# Altium schematic sheet Key_Matrix.SchDoc
size A4; SheetNumber: 1; SheetTotal: 1
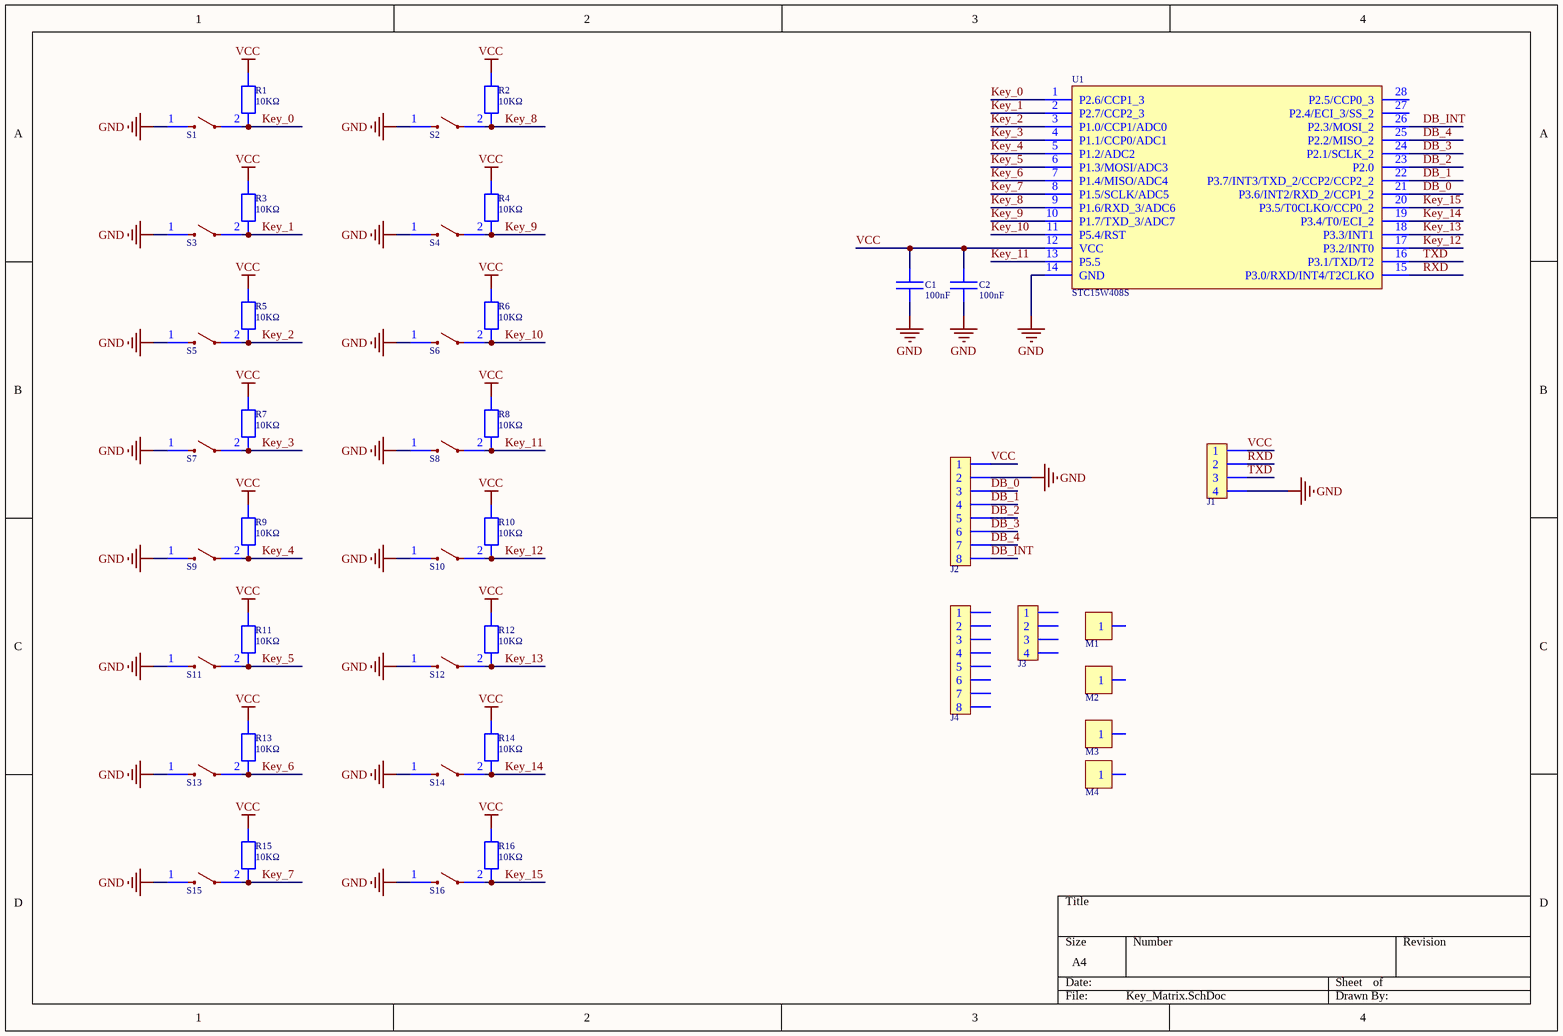
[diagram p0: Key_Matrix.SchDoc]

## Parts
C1  100nF  [C0603]
C2  100nF  [C0603]
J1  PinHeader_4Pin  [PinHeader_4Pin-2.54mm]  (value not drawn)
J2  PinHeader_8Pin  [PinHeader_8Pin-2.54mm]  (value not drawn)
J3  PinHeader_4Pin  [PinHeader_4Pin-2.54mm]  (value not drawn)
J4  PinHeader_8Pin  [PinHeader_8Pin-2.54mm]  (value not drawn)
M1  PCB Mounting Hole  [PCB Mounting Hole]  (value not drawn)
M2  PCB Mounting Hole  [PCB Mounting Hole]  (value not drawn)
M3  PCB Mounting Hole  [PCB Mounting Hole]  (value not drawn)
M4  PCB Mounting Hole  [PCB Mounting Hole]  (value not drawn)
R1  10KΩ  [R0805]
R2  10KΩ  [R0805]
R3  10KΩ  [R0805]
R4  10KΩ  [R0805]
R5  10KΩ  [R0805]
R6  10KΩ  [R0805]
R7  10KΩ  [R0805]
R8  10KΩ  [R0805]
R9  10KΩ  [R0805]
R10  10KΩ  [R0805]
R11  10KΩ  [R0805]
R12  10KΩ  [R0805]
R13  10KΩ  [R0805]
R14  10KΩ  [R0805]
R15  10KΩ  [R0805]
R16  10KΩ  [R0805]
S1  CK_RS282G05A3  [Tactile Button_SMD-SPST_L6.1-W3.7-H2.5]  (value not drawn)
S2  CK_RS282G05A3  [Tactile Button_SMD-SPST_L6.1-W3.7-H2.5]  (value not drawn)
S3  CK_RS282G05A3  [Tactile Button_SMD-SPST_L6.1-W3.7-H2.5]  (value not drawn)
S4  CK_RS282G05A3  [Tactile Button_SMD-SPST_L6.1-W3.7-H2.5]  (value not drawn)
S5  CK_RS282G05A3  [Tactile Button_SMD-SPST_L6.1-W3.7-H2.5]  (value not drawn)
S6  CK_RS282G05A3  [Tactile Button_SMD-SPST_L6.1-W3.7-H2.5]  (value not drawn)
S7  CK_RS282G05A3  [Tactile Button_SMD-SPST_L6.1-W3.7-H2.5]  (value not drawn)
S8  CK_RS282G05A3  [Tactile Button_SMD-SPST_L6.1-W3.7-H2.5]  (value not drawn)
S9  CK_RS282G05A3  [Tactile Button_SMD-SPST_L6.1-W3.7-H2.5]  (value not drawn)
S10  CK_RS282G05A3  [Tactile Button_SMD-SPST_L6.1-W3.7-H2.5]  (value not drawn)
S11  CK_RS282G05A3  [Tactile Button_SMD-SPST_L6.1-W3.7-H2.5]  (value not drawn)
S12  CK_RS282G05A3  [Tactile Button_SMD-SPST_L6.1-W3.7-H2.5]  (value not drawn)
S13  CK_RS282G05A3  [Tactile Button_SMD-SPST_L6.1-W3.7-H2.5]  (value not drawn)
S14  CK_RS282G05A3  [Tactile Button_SMD-SPST_L6.1-W3.7-H2.5]  (value not drawn)
S15  CK_RS282G05A3  [Tactile Button_SMD-SPST_L6.1-W3.7-H2.5]  (value not drawn)
S16  CK_RS282G05A3  [Tactile Button_SMD-SPST_L6.1-W3.7-H2.5]  (value not drawn)
U1  STC15W408S  [SOIC_28Pin-L17.9-W7.5]

## Nets
GND: C1.1 C2.1 J1.4 J2.2 S1.1 S2.1 S3.1 S4.1 S5.1 S6.1 S7.1 S8.1 S9.1 S10.1 S11.1 S12.1 S13.1 S14.1 S15.1 S16.1 U1.14(GND)
VCC: C1.2 C2.2 J1.1 J2.1 R1.2 R2.2 R3.2 R4.2 R5.2 R6.2 R7.2 R8.2 R9.2 R10.2 R11.2 R12.2 R13.2 R14.2 R15.2 R16.2 U1.12(VCC)
DB_0: J2.3 U1.21(P3.6/INT2/RXD_2/CCP1_2)
DB_1: J2.4 U1.22(P3.7/INT3/TXD_2/CCP2/CCP2_2)
DB_2: J2.5 U1.23(P2.0)
DB_3: J2.6 U1.24(P2.1/SCLK_2)
DB_4: J2.7 U1.25(P2.2/MISO_2)
DB_INT: J2.8 U1.26(P2.3/MOSI_2)
Key_0: R1.1 S1.2 U1.1(P2.6/CCP1_3)
Key_1: R3.1 S3.2 U1.2(P2.7/CCP2_3)
Key_2: R5.1 S5.2 U1.3(P1.0/CCP1/ADC0)
Key_3: R7.1 S7.2 U1.4(P1.1/CCP0/ADC1)
Key_4: R9.1 S9.2 U1.5(P1.2/ADC2)
Key_5: R11.1 S11.2 U1.6(P1.3/MOSI/ADC3)
Key_6: R13.1 S13.2 U1.7(P1.4/MISO/ADC4)
Key_7: R15.1 S15.2 U1.8(P1.5/SCLK/ADC5)
Key_8: R2.1 S2.2 U1.9(P1.6/RXD_3/ADC6)
Key_9: R4.1 S4.2 U1.10(P1.7/TXD_3/ADC7)
Key_10: R6.1 S6.2 U1.11(P5.4/RST)
Key_11: R8.1 S8.2 U1.13(P5.5)
Key_12: R10.1 S10.2 U1.17(P3.2/INT0)
Key_13: R12.1 S12.2 U1.18(P3.3/INT1)
Key_14: R14.1 S14.2 U1.19(P3.4/T0/ECI_2)
Key_15: R16.1 S16.2 U1.20(P3.5/T0CLKO/CCP0_2)
RXD: J1.2 U1.15(P3.0/RXD/INT4/T2CLKO)
TXD: J1.3 U1.16(P3.1/TXD/T2)

Not connected (* = marked no-connect by the designer): J3 1 2 3 4; J4 1 2 3 4 5 6 7 8; M1 1; M2 1; M3 1; M4 1; U1 27(P2.4/ECI_3/SS_2) 28(P2.5/CCP0_3)

## Library data of the parts
C1 C2 = Capacitor_0603: Value: 100nF
J1 J3 = PinHeader_4Pin: Straight Single Row, Square Pitch, 2.54mm
J2 J4 = PinHeader_8Pin: Straight Single Row, Square Pitch, 2.54mm
M1-M4 = PCB Mounting Hole: Mounting Hole
R1-R16 = Resistor_0805: Value: 10KΩ
S1-S16 = Button_Push_2Pin_SMD: Value: CK_RS282G05A3
U1 = STC15W408S_SOP28: Value: STC15W408S